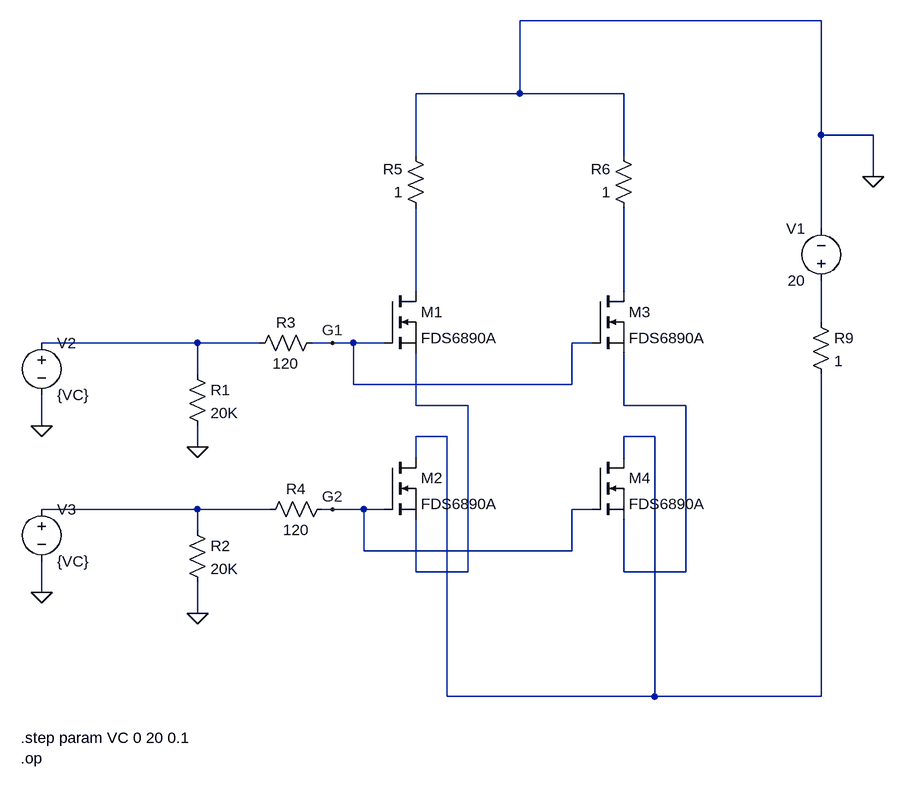
[diagram p0: schematic MosfetPowerControl.asc]
MosfetPowerControl.asc, the LTspice schematic file:
Version 4
SHEET 1 1572 684
WIRE 1280 -464 816 -464
WIRE 816 -352 816 -464
WIRE 816 -352 656 -352
WIRE 976 -352 816 -352
WIRE 1280 -288 1280 -464
WIRE 1360 -288 1280 -288
WIRE 656 -256 656 -352
WIRE 976 -256 976 -352
WIRE 1360 -224 1360 -288
WIRE 1280 -144 1280 -288
WIRE 656 -48 656 -176
WIRE 976 -48 976 -176
WIRE 1280 0 1280 -64
WIRE 320 32 80 32
WIRE 416 32 320 32
WIRE 528 32 496 32
WIRE 560 32 528 32
WIRE 608 32 560 32
WIRE 928 32 896 32
WIRE 320 80 320 32
WIRE 560 96 560 32
WIRE 896 96 896 32
WIRE 896 96 560 96
WIRE 656 128 656 48
WIRE 736 128 656 128
WIRE 976 128 976 48
WIRE 1072 128 976 128
WIRE 80 160 80 112
WIRE 704 176 656 176
WIRE 1024 176 976 176
WIRE 320 192 320 160
WIRE 656 208 656 176
WIRE 976 208 976 176
WIRE 320 288 80 288
WIRE 432 288 320 288
WIRE 528 288 512 288
WIRE 576 288 528 288
WIRE 608 288 576 288
WIRE 928 288 896 288
WIRE 320 320 320 288
WIRE 576 352 576 288
WIRE 896 352 896 288
WIRE 896 352 576 352
WIRE 656 384 656 304
WIRE 736 384 736 128
WIRE 736 384 656 384
WIRE 976 384 976 304
WIRE 1072 384 1072 128
WIRE 1072 384 976 384
WIRE 80 416 80 368
WIRE 320 448 320 400
WIRE 704 576 704 176
WIRE 1024 576 1024 176
WIRE 1024 576 704 576
WIRE 1280 576 1280 80
WIRE 1280 576 1024 576
FLAG 80 160 0
FLAG 80 416 0
FLAG 320 192 0
FLAG 320 448 0
FLAG 1360 -224 0
FLAG 528 32 G1
FLAG 528 288 G2
SYMBOL res 304 64 R0
SYMATTR InstName R1
SYMATTR Value 20K
SYMBOL res 304 304 R0
SYMATTR InstName R2
SYMATTR Value 20K
SYMBOL res 512 16 R90
WINDOW 0 0 56 VBottom 2
WINDOW 3 32 56 VTop 2
SYMATTR InstName R3
SYMATTR Value 120
SYMBOL res 528 272 R90
WINDOW 0 0 56 VBottom 2
WINDOW 3 32 56 VTop 2
SYMATTR InstName R4
SYMATTR Value 120
SYMBOL res 672 -160 R180
WINDOW 0 36 76 Left 2
WINDOW 3 36 40 Left 2
SYMATTR InstName R5
SYMATTR Value 1
SYMBOL res 992 -160 R180
WINDOW 0 36 76 Left 2
WINDOW 3 36 40 Left 2
SYMATTR InstName R6
SYMATTR Value 1
SYMBOL res 1264 -16 R0
SYMATTR InstName R9
SYMATTR Value 1
SYMBOL nmos 608 -48 R0
SYMATTR InstName M1
SYMATTR Value FDS6890A
SYMBOL nmos 928 -48 R0
SYMATTR InstName M3
SYMATTR Value FDS6890A
SYMBOL nmos 928 208 R0
SYMATTR InstName M4
SYMATTR Value FDS6890A
SYMBOL voltage 1280 -48 R180
WINDOW 0 24 96 Left 2
WINDOW 3 24 16 Left 2
WINDOW 123 0 0 Left 0
WINDOW 39 0 0 Left 0
SYMATTR InstName V1
SYMATTR Value 20
SYMBOL voltage 80 16 R0
SYMATTR InstName V2
SYMATTR Value {VC}
SYMBOL voltage 80 272 R0
SYMATTR InstName V3
SYMATTR Value {VC}
SYMBOL nmos 608 208 R0
SYMATTR InstName M2
SYMATTR Value FDS6890A
TEXT 48 640 Left 2 !.step param VC 0 20 0.1\n.op

The netlist it stands for:
* MosfetPowerControl.asc
R1 N004 0 20K
R2 N008 0 20K
R3 G1 N004 120
R4 G2 N008 120
R5 N001 0 1
R6 N002 0 1
R9 N003 N007 1
M1 N001 G1 N005 N005 FDS6890A
M3 N002 G1 N006 N006 FDS6890A
M4 N007 G2 N006 N006 FDS6890A
V1 N003 0 20
V2 N004 0 {VC}
V3 N008 0 {VC}
M2 N007 G2 N005 N005 FDS6890A
.model NMOS NMOS
.model PMOS PMOS
.lib standard.mos
.step param VC 0 20 0.1
.op
.backanno
.end